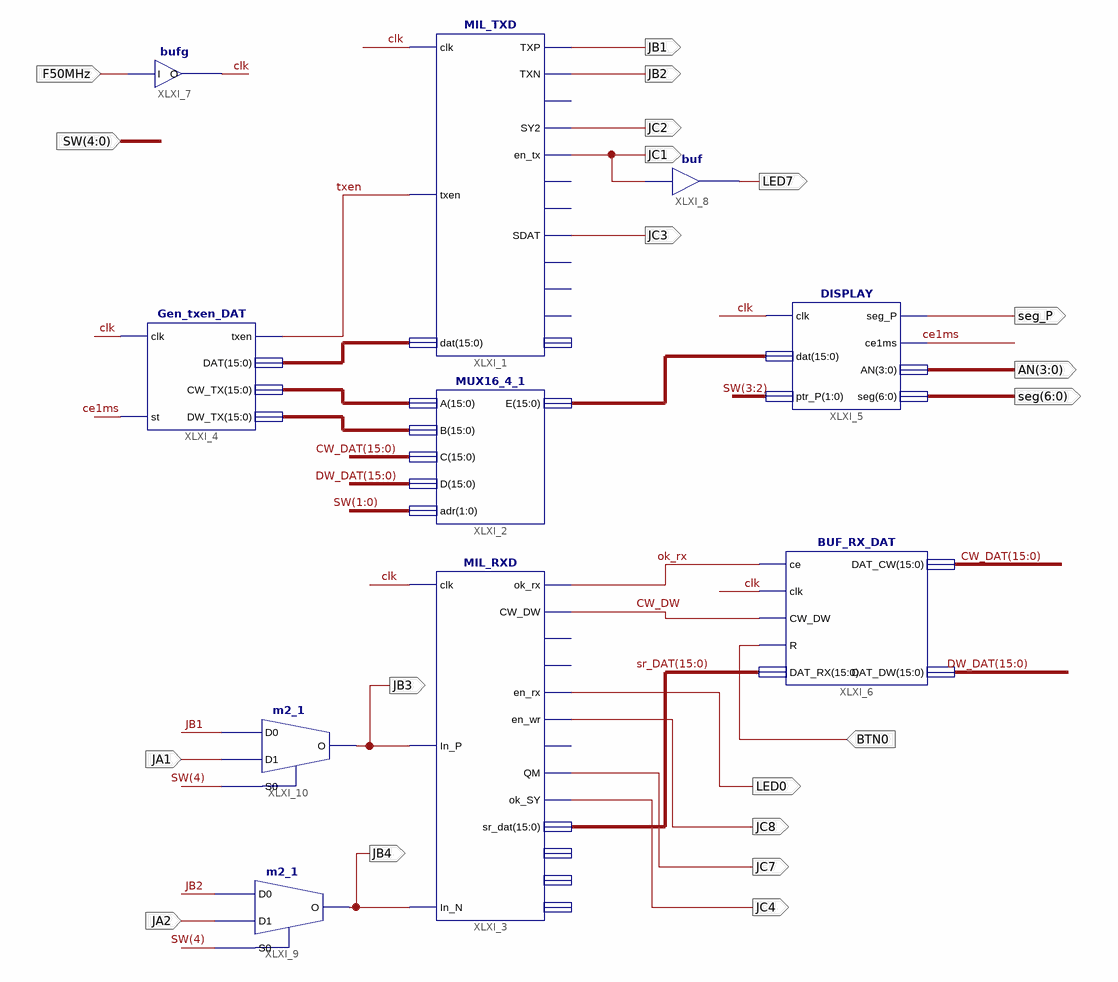
[diagram p0: schematic sheet 1]
// Xilinx ISE schematic Sch.sch (spartan3e) as structural Verilog: 10 symbols, 20 ports
module Sch (
  input  BTN0,
  input  F50MHz,
  input  [4:0] SW,
  input  JA1,
  input  JA2,
  output seg_P,
  output [3:0] AN,
  output [6:0] seg,
  output JB1,
  output JB2,
  output JC2,
  output JC1,
  output JC3,
  output JB4,
  output LED0,
  output JC8,
  output JC7,
  output JC4,
  output LED7,
  output JB3
);

  wire ce1ms, clk, CW_DW, ok_rx, txen;
  wire [15:0] CW_DAT, DW_DAT, sr_DAT, XLXN_11, XLXN_22, XLXN_23, XLXN_24;

  MIL_TXD XLXI_1 (
    .clk(clk), .txen(txen), .dat(XLXN_22), .TXP(JB1), .TXN(JB2), .SY2(JC2), .en_tx(JC1), .SDAT(JC3));  // open: SY1, T_dat, T_end, FT_cp, ce_tact, CW_DW, cb_bit
  MUX16_4_1 XLXI_2 (.A(XLXN_23), .B(XLXN_24), .C(CW_DAT), .D(DW_DAT), .adr(SW[1:0]), .E(XLXN_11));
  MIL_RXD XLXI_3 (
    .clk(clk), .In_P(JB3), .In_N(JB4), .ok_rx(ok_rx), .CW_DW(CW_DW), .en_rx(LED0), .en_wr(JC8), .QM(JC7),
    .ok_SY(JC4), .sr_dat(sr_DAT));  // open: T_end, FT_cp, ce_tact, cb_tact, cb_bit, cb_XOR
  Gen_txen_DAT XLXI_4 (.clk(clk), .st(ce1ms), .txen(txen), .DAT(XLXN_22), .CW_TX(XLXN_23), .DW_TX(XLXN_24));
  DISPLAY XLXI_5 (.clk(clk), .dat(XLXN_11), .ptr_P(SW[3:2]), .seg_P(seg_P), .ce1ms(ce1ms), .AN(AN), .seg(seg));
  BUF_RX_DAT XLXI_6 (.ce(ok_rx), .clk(clk), .CW_DW(CW_DW), .R(BTN0), .DAT_RX(sr_DAT), .DAT_CW(CW_DAT), .DAT_DW(DW_DAT));
  bufg XLXI_7 (.I(F50MHz), .O(clk));
  buf XLXI_8 (LED7, JC1);
  m2_1 XLXI_9 (.D0(JB2), .D1(JA2), .S0(SW[4]), .O(JB4));
  m2_1 XLXI_10 (.D0(JB1), .D1(JA1), .S0(SW[4]), .O(JB3));
endmodule
